# Altium schematic sheet Sheet_1_2025-07-04.schdoc
size 461 x 251 mm
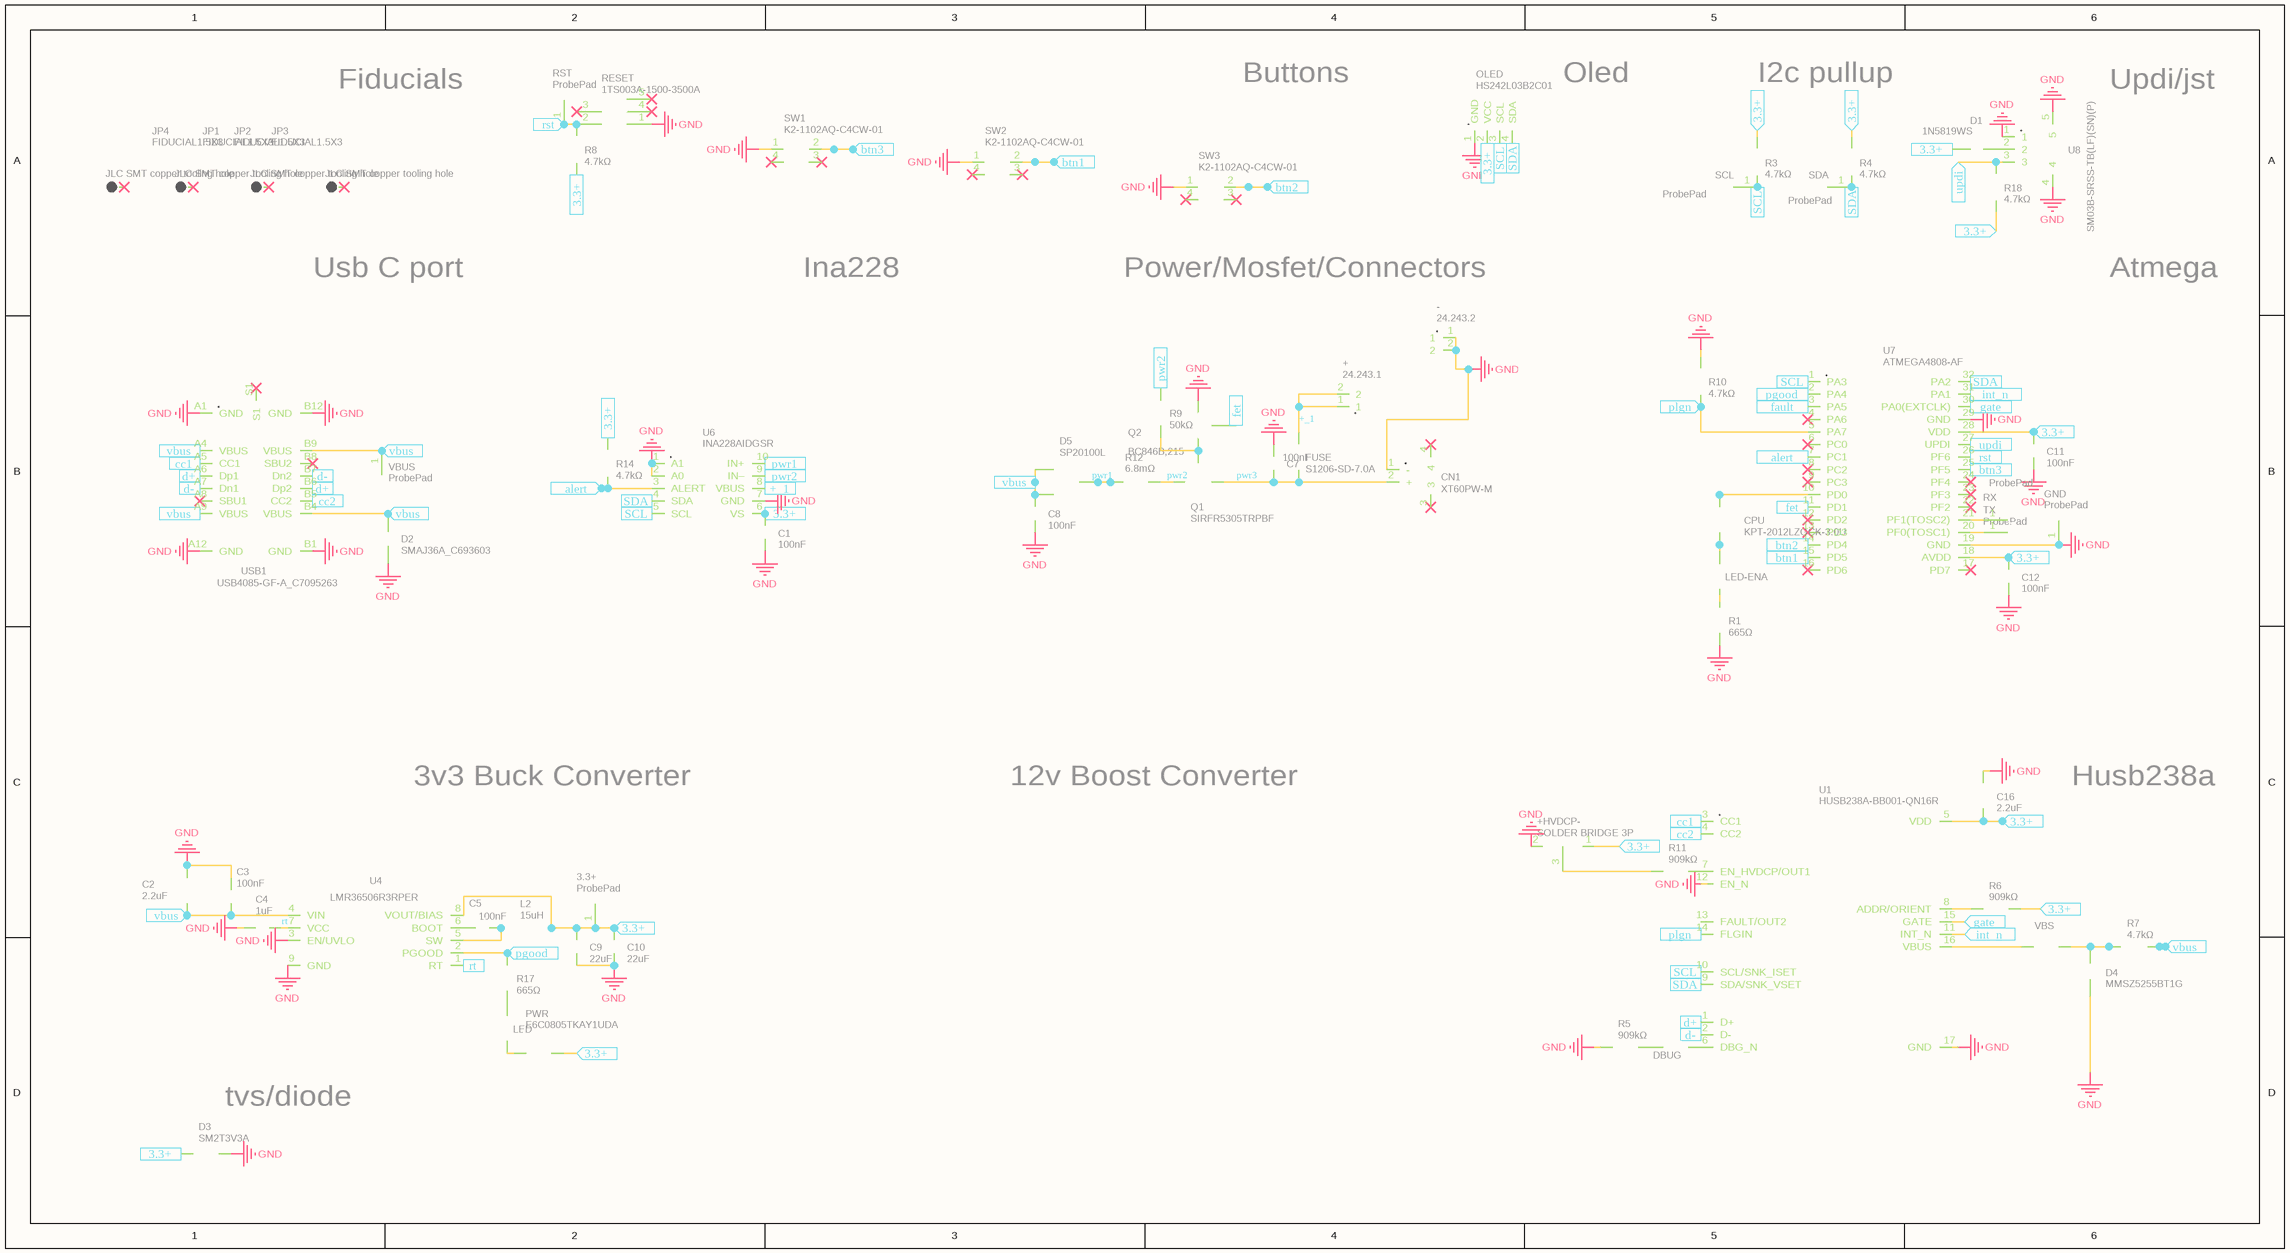
[diagram p0: Sheet_1_2025-07-04.schdoc]

## Parts
3.3+  ProbePad  [PROBEPAD]
+  24.243.1  [AUDIO-TH_24.243.1]
+HVDCP-  SOLDER BRIDGE 3P  [SOLDER BRIDGE 3P UNBRIDGED]
-  24.243.2  [CONN-TH_24.243.2]
C1  100nF  [C0805]
C2  2.2uF  [C0805]
C3  100nF  [C0805]
C4  1uF  [C0805]
C5  100nF  [C0805]
C7  100nF  [C0805]
C8  100nF  [C0805]
C9  22uF  [C0805]
C10  22uF  [C0805]
C11  100nF  [C0805]
C12  100nF  [C0805]
C16  2.2uF  [C0805]
CN1  XT60PW-M  [CONN-TH_XT60PW-M]
CPU  KPT-2012LZGCK-3.0U  [LED0805_GREEN]
D1  1N5819WS  [SOD-323_L1.8-W1.3-LS2.5-RD]
D2  SMAJ36A_C693603  [SMA_L4.3-W2.6-LS5.0-RD]
D3  SM2T3V3A  [DO-216AA_L1.9-W1.9-LS3.8-FD]
D4  MMSZ5255BT1G  [SOD-123_L2.7-W1.6-LS3.7-RD]
D5  SP20100L  [TO-277B_3P-L6.1-W4.3-LS6.5-BR]
DBUG  SOLDER BRIDGE  [NGB_SOLDER_BRIDGE]  (value not drawn)
FUSE  S1206-SD-7.0A  [F1206]
GND  ProbePad  [PROBEPAD]
JP1  FIDUCIAL1.5X3  [FIDUCIAL-1.5X3]
JP2  FIDUCIAL1.5X3  [FIDUCIAL-1.5X3]
JP3  FIDUCIAL1.5X3  [FIDUCIAL-1.5X3]
JP4  FIDUCIAL1.5X3  [FIDUCIAL-1.5X3]
L2  15uH  [IND-SMD_L4.0-W4.0]
LED  SOLDER BRIDGE  [NGB_SOLDER_BRIDGE]  (value not drawn)
LED-ENA  SOLDER BRIDGE  [NGB_SOLDER_BRIDGE]  (value not drawn)
OLED  HS242L03B2C01  [OLED-TH_4P-L72.0-W43.0-P2.54]
PWR  E6C0805TKAY1UDA  [LED0805-RD_BLUE]
Q1  SIRFR5305TRPBF  [TO-252-3_L6.5-W6.1-P4.58-BR]
Q2  BC846B,215  [SOT-23-3_L2.9-W1.6-P1.90-LS2.8-BR]
R1  665Ω  [R0805]
R3  4.7kΩ  [R0805]
R4  4.7kΩ  [R0805]
R5  909kΩ  [R0805]
R6  909kΩ  [R0805]
R7  4.7kΩ  [R0805]
R8  4.7kΩ  [R0805]
R9  50kΩ  [R0805]
R10  4.7kΩ  [R0805]
R11  909kΩ  [R0805]
R12  6.8mΩ  [R2817]
R14  4.7kΩ  [R0805]
R17  665Ω  [R0805]
R18  4.7kΩ  [R0805]
RESET  1TS003A-1500-3500A  [KEY-SMD_1TS003A]
RST  ProbePad  [PROBEPAD]
RX  ProbePad  [PROBEPAD]
SCL  ProbePad  [PROBEPAD]
SDA  ProbePad  [PROBEPAD]
SW1  K2-1102AQ-C4CW-01  [SW-TH_K2-1102AQ-C4CW-01]
SW2  K2-1102AQ-C4CW-01  [SW-TH_K2-1102AQ-C4CW-01]
SW3  K2-1102AQ-C4CW-01  [SW-TH_K2-1102AQ-C4CW-01]
TH1  JLC SMT copper tooling hole  [JLC_SMT_COPPER_TOOLING_HOLE]
TH2  JLC SMT copper tooling hole  [JLC_SMT_COPPER_TOOLING_HOLE]
TH3  JLC SMT copper tooling hole  [JLC_SMT_COPPER_TOOLING_HOLE]
TH4  JLC SMT copper tooling hole  [JLC_SMT_COPPER_TOOLING_HOLE]
TX  ProbePad  [PROBEPAD]
U1  HUSB238A-BB001-QN16R  [QFN-16_L3.0-W3.0-P0.50-BL-EP1.7]
U4  LMR36506R3RPER  [VQFN-9_L2.0-W2.0-P0.50-TL]
U6  INA228AIDGSR  [VSSOP-10_L3.0-W3.0-P0.50-LS4.9-BL]
U7  ATMEGA4808-AF  [TQFP-32_L7.0-W7.0-P0.80-LS9.0-BL]
U8  SM03B-SRSS-TB(LF)(SN)(P)  [CONN-SMD_SM03B-SRSS-TB-LF-SN-P]
USB1  USB4085-GF-A_C7095263  [USC-C-SMD_USB4085-GF-A]
VBS  SOLDER BRIDGE  [NGB_SOLDER_BRIDGE]  (value not drawn)
VBUS  ProbePad  [PROBEPAD]

## Blocks framed on the sheet
Fiducials: JP1-JP4 TH1-TH4
Buttons: R8 RESET RST SW1-SW3
Oled: OLED
I2c pullup: R3 R4 SCL SDA
Updi/jst: D1 R18 U8
Usb C port: D2 USB1 VBUS
Ina228: C1 R14 U6
Power/Mosfet/Connectors: + - C7 C8 CN1 D5 FUSE Q1 Q2 R9 R12
Atmega: C11 C12 CPU GND LED-ENA R1 R10 RX TX U7
3v3 Buck Converter: 3.3+ C2-C5 C9 C10 L2 LED PWR R17 U4
tvs/diode: D3

## Ports
3.3+ (in), +_1 (in), alert (in), btn1 (in), btn2 (in), btn3 (in), cc1 (in), cc2 (in), d+ (in), d- (in), fault (in), fet (in), gate (in), int_n (in), pgood (in), plgn (in), pwr1 (in), pwr2 (in), rst (in), rt (in), SCL (in), SDA (in), updi (in), vbus (in)

## Nets
GND: +HVDCP-.2 -.1 -.2 C1.2 C2.2 C3.2 C4.2 C7.1 C8.2 C9.1 C10.1 C11.2 C12.2 C16.1 CN1.1(-) D2.2 D3.1(A) D4.2(A) GND.1 OLED.1(GND) Q2.2(E) R1.2 R5.1 R10.2 RESET.1(A) SW1.1 SW2.1 SW3.1 U1.12(EN_N) U1.17(GND) U4.3(EN/UVLO) U4.9(GND) U6.1(A1) U6.2(A0) U6.7(GND) U7.19(GND) U7.29(GND) U8.1 U8.4 U8.5 USB1.A1(GND) USB1.A12(GND) USB1.B1(GND) USB1.B12(GND)
3.3+: 3.3+.1 +HVDCP-.1 C1.1 C9.2 C10.2 C11.1 C12.1 C16.2 D1.1(K) D3.2(K) L2.2 OLED.2(VCC) PWR.2(A) R3.1 R4.1 R6.2 R8.1 R14.1 R18.2 U1.5(VDD) U4.8(VOUT/BIAS) U6.6(VS) U7.18(AVDD) U7.28(VDD) ; port 3.3+
+_1: +.1 +.2 FUSE.1
+_1: U6.8(VBUS) ; port +_1  [a separate net that carries the same name]
alert: R14.2 U6.3(ALERT) U7.7(PC1) ; port alert
btn1: SW2.2 U7.15(PD5) ; port btn1
btn2: SW3.2 U7.14(PD4) ; port btn2
btn3: SW1.2 U7.25(PF5) ; port btn3
cc1: U1.3(CC1) USB1.A5(CC1) ; port cc1
cc2: U1.4(CC2) USB1.B5(CC2) ; port cc2
d+: U1.1(D+) USB1.A6(Dp1) USB1.B6(Dp2) ; port d+
d-: U1.2(D-) USB1.A7(Dn1) USB1.B7(Dn2) ; port d-
fault: U7.3(PA5) ; port fault
fet: Q2.1(B) U7.11(PD1) ; port fet
gate: U1.15(GATE) U7.30(PA0(EXTCLK)) ; port gate
int_n: U1.11(INT_N) U7.31(PA1) ; port int_n
pgood: R17.2 U4.2(PGOOD) U7.2(PA4) ; port pgood
plgn: R10.1 U1.14(FLGIN) U7.5(PA7) ; port plgn
pwr1: D5.3(K) R12.1
pwr1: U6.10(IN+) ; port pwr1  [a separate net that carries the same name]
pwr2: Q1.3(S) R12.2
pwr2: R9.2 U6.9(IN–) ; port pwr2  [a separate net that carries the same name]
pwr3: C7.2 CN1.2(+) FUSE.2 Q1.2(D)
rst: R8.2 RESET.2(B) RST.1 U7.26(PF6) ; port rst
rt: U4.1(RT) ; port rt
rt: C4.1 U4.7(VCC)  [a separate net that carries the same name]
SCL: OLED.3(SCL) R3.2 SCL.1 U1.10(SCL/SNK_ISET) U6.5(SCL) U7.1(PA3) ; port SCL
SDA: OLED.4(SDA) R4.2 SDA.1 U1.9(SDA/SNK_VSET) U6.4(SDA) U7.32(PA2) ; port SDA
updi: R18.1 U7.27(UPDI) U8.3 ; port updi
vbus: C2.1 C3.1 C8.1 D2.1 D5.1(A) D5.2(A) R7.1 U4.4(VIN) USB1.A4(VBUS) USB1.A9(VBUS) USB1.B4(VBUS) USB1.B9(VBUS) VBUS.1 ; port vbus
Net+HVDCP-_3: +HVDCP-.3 R11.1
NetC5_1: C5.1 L2.1 U4.5(SW)
NetC5_2: C5.2 U4.6(BOOT)
NetCPU_1: CPU.1(A) U7.10(PD0)
NetCPU_2: CPU.2(K) LED-ENA.2
NetD1_2: D1.2(A) U8.2
NetD4_1: D4.1(K) R7.2 VBS.1
NetDBUG_1: DBUG.1 R5.2
NetDBUG_2: DBUG.2 U1.6(DBG_N)
NetLED-ENA_1: LED-ENA.1 R1.1
NetLED_1: LED.1 PWR.1(K)
NetLED_2: LED.2 R17.1
NetQ1_1: Q1.1(G) Q2.3(C) R9.1
NetR6_1: R6.1 U1.8(ADDR/ORIENT)
NetR11_2: R11.2 U1.7(EN_HVDCP/OUT1)
NetRX_1: RX.1 U7.21(PF1(TOSC2))
NetTX_1: TX.1 U7.20(PF0(TOSC1))
NetU1_16: U1.16(VBUS) VBS.2

Not connected (* = marked no-connect by the designer): CN1 3* 4*; RESET 3* 4* 5*; SW1 3* 4*; SW2 3* 4*; SW3 3* 4*; TH1 1*; TH2 1*; TH3 1*; TH4 1*; U1 13(FAULT/OUT2); U7 4(PA6)* 6(PC0)* 8(PC2)* 9(PC3)* 12(PD2)* 13(PD3)* 16(PD6)* 17(PD7)* 22(PF2)* 23(PF3)* 24(PF4)*; USB1 A8(SBU1)* B8(SBU2)* S1*

## Notes on the sheet
- 12v Boost Converter
- Husb238a

## Library data of the parts
3.3+ GND RST RX SCL SDA TX VBUS = ProbePad: Contributor: pobajobs; spicePre: P; spiceSymbolName: ProbePad
+ = 24.243.1: Manufacturer: AMASS(艾迈斯); Contributor: alexravelo686; Supplier: LCSC; Supplier Part: C7437321; Manufacturer Part: 24.243.1; JLCPCB Part Class: Extended Part; spicePre: U; spiceSymbolName: 24.243.1
+HVDCP- = SOLDER BRIDGE 3P: Contributor: leif; spicePre: J; spiceSymbolName: SOLDER BRIDGE
- = 24.243.2: Manufacturer: AMASS(艾迈斯); Contributor: alexravelo686; Supplier: LCSC; Supplier Part: C7437322; Manufacturer Part: 24.243.2; JLCPCB Part Class: Extended Part; link: https://lcsc.com/eda_search?q=C7437322&%26type=1&ref=editor; spicePre: C; spiceSymbolName: 24.243.2
C1 C3 C5 C7 C8 C11 C12 = 100nF: Manufacturer Part: CL21B104KCFNNNE; Manufacturer: SAMSUNG(三星); nameAlias: Value; Supplier: LCSC; Supplier Part: C28233; JLCPCB Part Class: Basic Part; spicePre: C; spiceSymbolName: CL21B104KCFNNNE
C2 C16 = 2.2uF: Manufacturer: HRE(芯声); Manufacturer Part: CGA0805X7R225K630MT; nameAlias: Value; Contributor: lcsc; Supplier: LCSC; Supplier Part: C6119940; JLCPCB Part Class: Extended Part; spicePre: C; spiceSymbolName: CGA0805X7R225K630MT
C4 = 1uF: Manufacturer: YAGEO(国巨); Manufacturer Part: CC0805KKX7R7BB105; nameAlias: Value; Supplier: LCSC; Supplier Part: C94122; JLCPCB Part Class: Extended Part; spicePre: C; spiceSymbolName: CC0805KKX7R7BB105
C9 C10 = 22uF: Manufacturer Part: CL21A226MPQNNNE; Manufacturer: SAMSUNG(三星); nameAlias: Value; Supplier: LCSC; Supplier Part: C29277; JLCPCB Part Class: Extended Part; spicePre: C; spiceSymbolName: CL21A226MPQNNNE
CN1 = XT60PW-M: Manufacturer: AMASS(艾迈斯); Contributor: LCSC; Supplier: LCSC; Supplier Part: C98732; Manufacturer Part: XT60PW-M; JLCPCB Part Class: Extended Part; spicePre: C; spiceSymbolName: XT60PW-M
CPU = KPT-2012LZGCK-3.0U: Manufacturer: Kingbright; Contributor: lcsc; Supplier: LCSC; Supplier Part: C22367419; Manufacturer Part: KPT-2012LZGCK-3.0U; JLCPCB Part Class: Extended Part; spicePre: L; spiceSymbolName: KPT-2012LZGCK-3.0U
D1 = 1N5819WS: Manufacturer: Hottech(合科泰); Contributor: LCSC; Supplier: LCSC; Supplier Part: C191023; Manufacturer Part: 1N5819WS; JLCPCB Part Class: Basic Part; spicePre: D; spiceSymbolName: 1N5819WS
D2 = SMAJ36A_C693603: Manufacturer: FTR(乔光电子); Contributor: LCSC; Supplier: LCSC; Supplier Part: C693603; Manufacturer Part: SMAJ36A; JLCPCB Part Class: Extended Part; spicePre: D; spiceSymbolName: SMAJ36A_C693603
D3 = SM2T3V3A: Manufacturer: ST(意法半导体); Contributor: LCSC; Supplier: LCSC; Supplier Part: C970557; Manufacturer Part: SM2T3V3A; JLCPCB Part Class: Extended Part; spicePre: D; spiceSymbolName: SM2T3V3A
D4 = MMSZ5255BT1G: Manufacturer: onsemi(安森美); Contributor: LCSC; Supplier: LCSC; Supplier Part: C242284; Manufacturer Part: MMSZ5255BT1G; JLCPCB Part Class: Extended Part; spicePre: D; spiceSymbolName: MMSZ5255BT1G
D5 = SP20100L: Manufacturer: DOWO(东沃); Contributor: lcsc; Supplier: LCSC; Supplier Part: C20199374; Manufacturer Part: SP20100L; JLCPCB Part Class: Extended Part; spicePre: D; spiceSymbolName: SP20100L
DBUG LED LED-ENA VBS = SOLDER BRIDGE: Manufacturer: NONE; Manufacturer Part: 0603WAF0000T5E; nameAlias: Value; Contributor: anirudh.vn; Supplier: LCSC; Supplier Part: C21189; spicePre: S; spiceSymbolName: SOLDER BRIDGE
FUSE = S1206-SD-7.0A: Manufacturer: SART(萨特); Contributor: LCSC; Supplier: LCSC; Supplier Part: C183154; Manufacturer Part: S1206-SD-7.0A; JLCPCB Part Class: Extended Part; spicePre: U; spiceSymbolName: S1206-SD-7.0A
JP1-JP4 = FIDUCIAL1.5X3: Contributor: dp1000; spicePre: J; spiceSymbolName: FIDUCIAL1.5X3
L2 = 15uH: Manufacturer: YJYCOIN(益嘉源); Manufacturer Part: YNR4018-150M; nameAlias: Value; Contributor: LCSC; Supplier: LCSC; Supplier Part: C340372; JLCPCB Part Class: Extended Part; spicePre: L; spiceSymbolName: YNR4018-15OM
OLED = HS242L03B2C01: Manufacturer: HS(汉昇); Contributor: lcsc; Supplier: LCSC; Supplier Part: C7466000; Manufacturer Part: HS242L03B2C01; JLCPCB Part Class: Extended Part; spicePre: O; spiceSymbolName: HS242L03B2C01
PWR = E6C0805TKAY1UDA: Manufacturer: ekinglux(亿晶源); Contributor: lcsc; Supplier: LCSC; Supplier Part: C2859407; Manufacturer Part: E6C0805TKAY1UDA; JLCPCB Part Class: Extended Part; spicePre: L; spiceSymbolName: E6C0805TKAY1UDA
Q1 = SIRFR5305TRPBF: Manufacturer: JSMSEMI(杰盛微); Contributor: lcsc; Supplier: LCSC; Supplier Part: C20754790; Manufacturer Part: SIRFR5305TRPBF; JLCPCB Part Class: Extended Part; spicePre: Q; spiceSymbolName: SIRFR5305TRPBF
Q2 = BC846B,215: Manufacturer: Nexperia(安世); Contributor: LCSC; Supplier: LCSC; Manufacturer Part: BC846B,215; Supplier Part: C87062; JLCPCB Part Class: Extended Part; spicePre: Q; spiceSymbolName: BC846B,215
R1 R17 = 665Ω: Manufacturer: Viking(光颉); Manufacturer Part: ARG05BTC6650N; nameAlias: Value; Contributor: lcsc; Supplier: LCSC; Supplier Part: C2684586; JLCPCB Part Class: Extended Part; spicePre: R; spiceSymbolName: ARG05BTC6650N
R3 R4 R7 R8 R10 R14 R18 = 4.7kΩ: Manufacturer: UNI-ROYAL(厚声); Manufacturer Part: 0805W8F4701T5E; nameAlias: Value; Supplier: LCSC; Supplier Part: C17673; JLCPCB Part Class: Basic Part; spicePre: R; spiceSymbolName: 0805W8F4701T5E
R5 R6 R11 = 909kΩ: Manufacturer: Walsin(华新科); Manufacturer Part: WR08X9093FTL; nameAlias: Value; Contributor: LCSC; Supplier: LCSC; Supplier Part: C170980; JLCPCB Part Class: Extended Part; spicePre: R; spiceSymbolName: WR08X9093FTL
R9 = 50kΩ: Manufacturer: Viking(光颉); Manufacturer Part: ARG05DTC5002; nameAlias: Value; Contributor: lcsc; Supplier: LCSC; Supplier Part: C2828840; JLCPCB Part Class: Extended Part; spicePre: R; spiceSymbolName: ARG05DTC5002
R12 = 6.8mΩ: Manufacturer: Isabellenhuette(伊萨普兰); Manufacturer Part: SMT-R0068-1.0; nameAlias: Value; Contributor: LCSC; Supplier: LCSC; Supplier Part: C466588; JLCPCB Part Class: Extended Part; spicePre: R; spiceSymbolName: SMT-R0068-1.0
RESET = 1TS003A-1500-3500A: Manufacturer: HYP(鸿源精密); Manufacturer Part: 1TS003A-1500-3500A-CT; Contributor: LCSC; Supplier: LCSC; Supplier Part: C319382; JLCPCB Part Class: Extended Part; spicePre: S; spiceSymbolName: 1TS003A-1500-3500A
SW1-SW3 = K2-1102AQ-C4CW-01: Manufacturer: 韩国韩荣; Contributor: LCSC; Supplier: LCSC; Manufacturer Part: K2-1102AQ-C4CW-01; Supplier Part: C127680; JLCPCB Part Class: Extended Part; spicePre: S; spiceSymbolName: K2-1102AQ-C4CW-01
TH1-TH4 = JLC SMT copper tooling hole: Contributor: mohsenmirzaie790; Supplier Part: x; spicePre: H; spiceSymbolName: JLC SMT copper tooling hole
U1 = HUSB238A-BB001-QN16R: Manufacturer: Hynetek(慧能泰); Contributor: lcsc; Supplier: LCSC; Supplier Part: C24833806; Manufacturer Part: HUSB238A-BB001-QN16R; JLCPCB Part Class: Extended Part; spicePre: U; spiceSymbolName: HUSB238A-BB001-QN16R
U4 = LMR36506R3RPER: Manufacturer: TI(德州仪器); Contributor: lcsc; Supplier: LCSC; Supplier Part: C3190188; Manufacturer Part: LMR36506R3RPER; JLCPCB Part Class: Extended Part; spicePre: U; spiceSymbolName: LMR36506R3RPER
U6 = INA228AIDGSR: Manufacturer: TI(德州仪器); Contributor: LCSC; Supplier: LCSC; Supplier Part: C2887910; Manufacturer Part: INA228AIDGSR; JLCPCB Part Class: Extended Part; spicePre: U; spiceSymbolName: INA228AIDGSR
U7 = ATMEGA4808-AF: Manufacturer: MICROCHIP(美国微芯); Contributor: LCSC; Supplier: LCSC; Supplier Part: C1340045; Manufacturer Part: ATMEGA4808-AF; JLCPCB Part Class: Extended Part; spicePre: U; spiceSymbolName: ATMEGA4808-AF
U8 = SM03B-SRSS-TB(LF)(SN)(P): Manufacturer: JST; Contributor: LCSC; Supplier: LCSC; Supplier Part: C160403; Manufacturer Part: SM03B-SRSS-TB(LF)(SN); JLCPCB Part Class: Extended Part; spicePre: U; spiceSymbolName: SM03B-SRSS-TB(LF)(SN)(P)
USB1 = USB4085-GF-A_C7095263: Manufacturer: GCT; Contributor: lcsc; Supplier: LCSC; Supplier Part: C7095263; Manufacturer Part: USB4085-GF-A; JLCPCB Part Class: Extended Part; spicePre: U; spiceSymbolName: USB4085-GF-A_C7095263